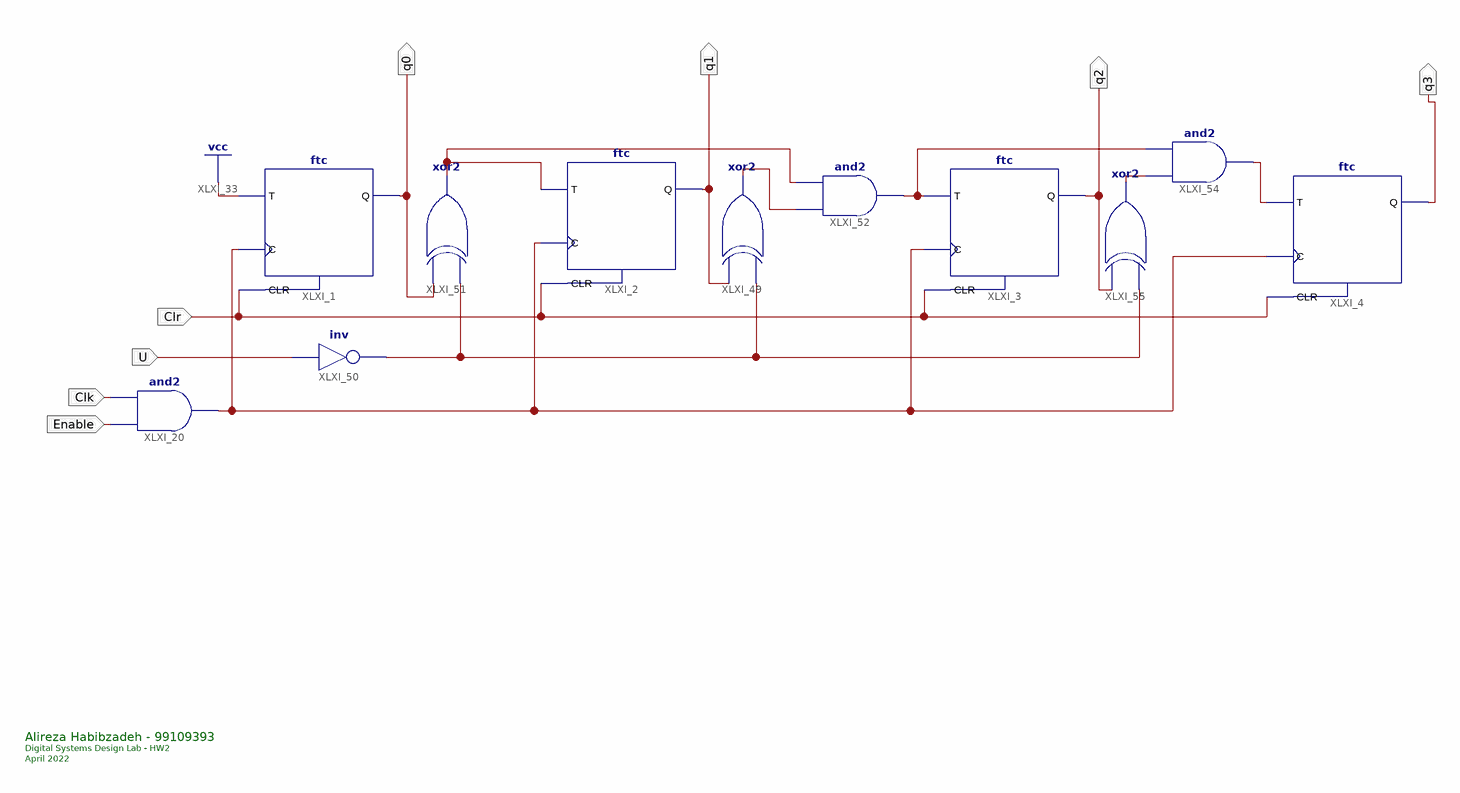
[diagram p0: schematic sheet 1]
// Xilinx ISE schematic my_counter.sch (artix7) as structural Verilog: 11 symbols, 8 ports
module my_counter (
  input  Enable,
  input  Clk,
  input  U,
  input  Clr,
  output q3,
  output q0,
  output q1,
  output q2
);

  wire XLXN_77, XLXN_95, XLXN_148, XLXN_149, XLXN_151, XLXN_152, XLXN_162;

  ftc XLXI_2 (.C(XLXN_77), .CLR(Clr), .T(XLXN_149), .Q(q1));
  ftc XLXI_1 (.C(XLXN_77), .CLR(Clr), .T(1'b1), .Q(q0));
  and XLXI_20 (XLXN_77, Enable, Clk);
  not XLXI_50 (XLXN_148, U);
  xor XLXI_51 (XLXN_149, XLXN_148, q0);
  xor XLXI_49 (XLXN_151, XLXN_148, q1);
  ftc XLXI_3 (.C(XLXN_77), .CLR(Clr), .T(XLXN_95), .Q(q2));
  and XLXI_52 (XLXN_95, XLXN_151, XLXN_149);
  xor XLXI_55 (XLXN_162, XLXN_148, q2);
  and XLXI_54 (XLXN_152, XLXN_162, XLXN_95);
  ftc XLXI_4 (.C(XLXN_77), .CLR(Clr), .T(XLXN_152), .Q(q3));

  // Notes on the sheet:
  //   Alireza Habibzadeh - 99109393
  //   Digital Systems Design Lab - HW2
  //   April 2022
endmodule
